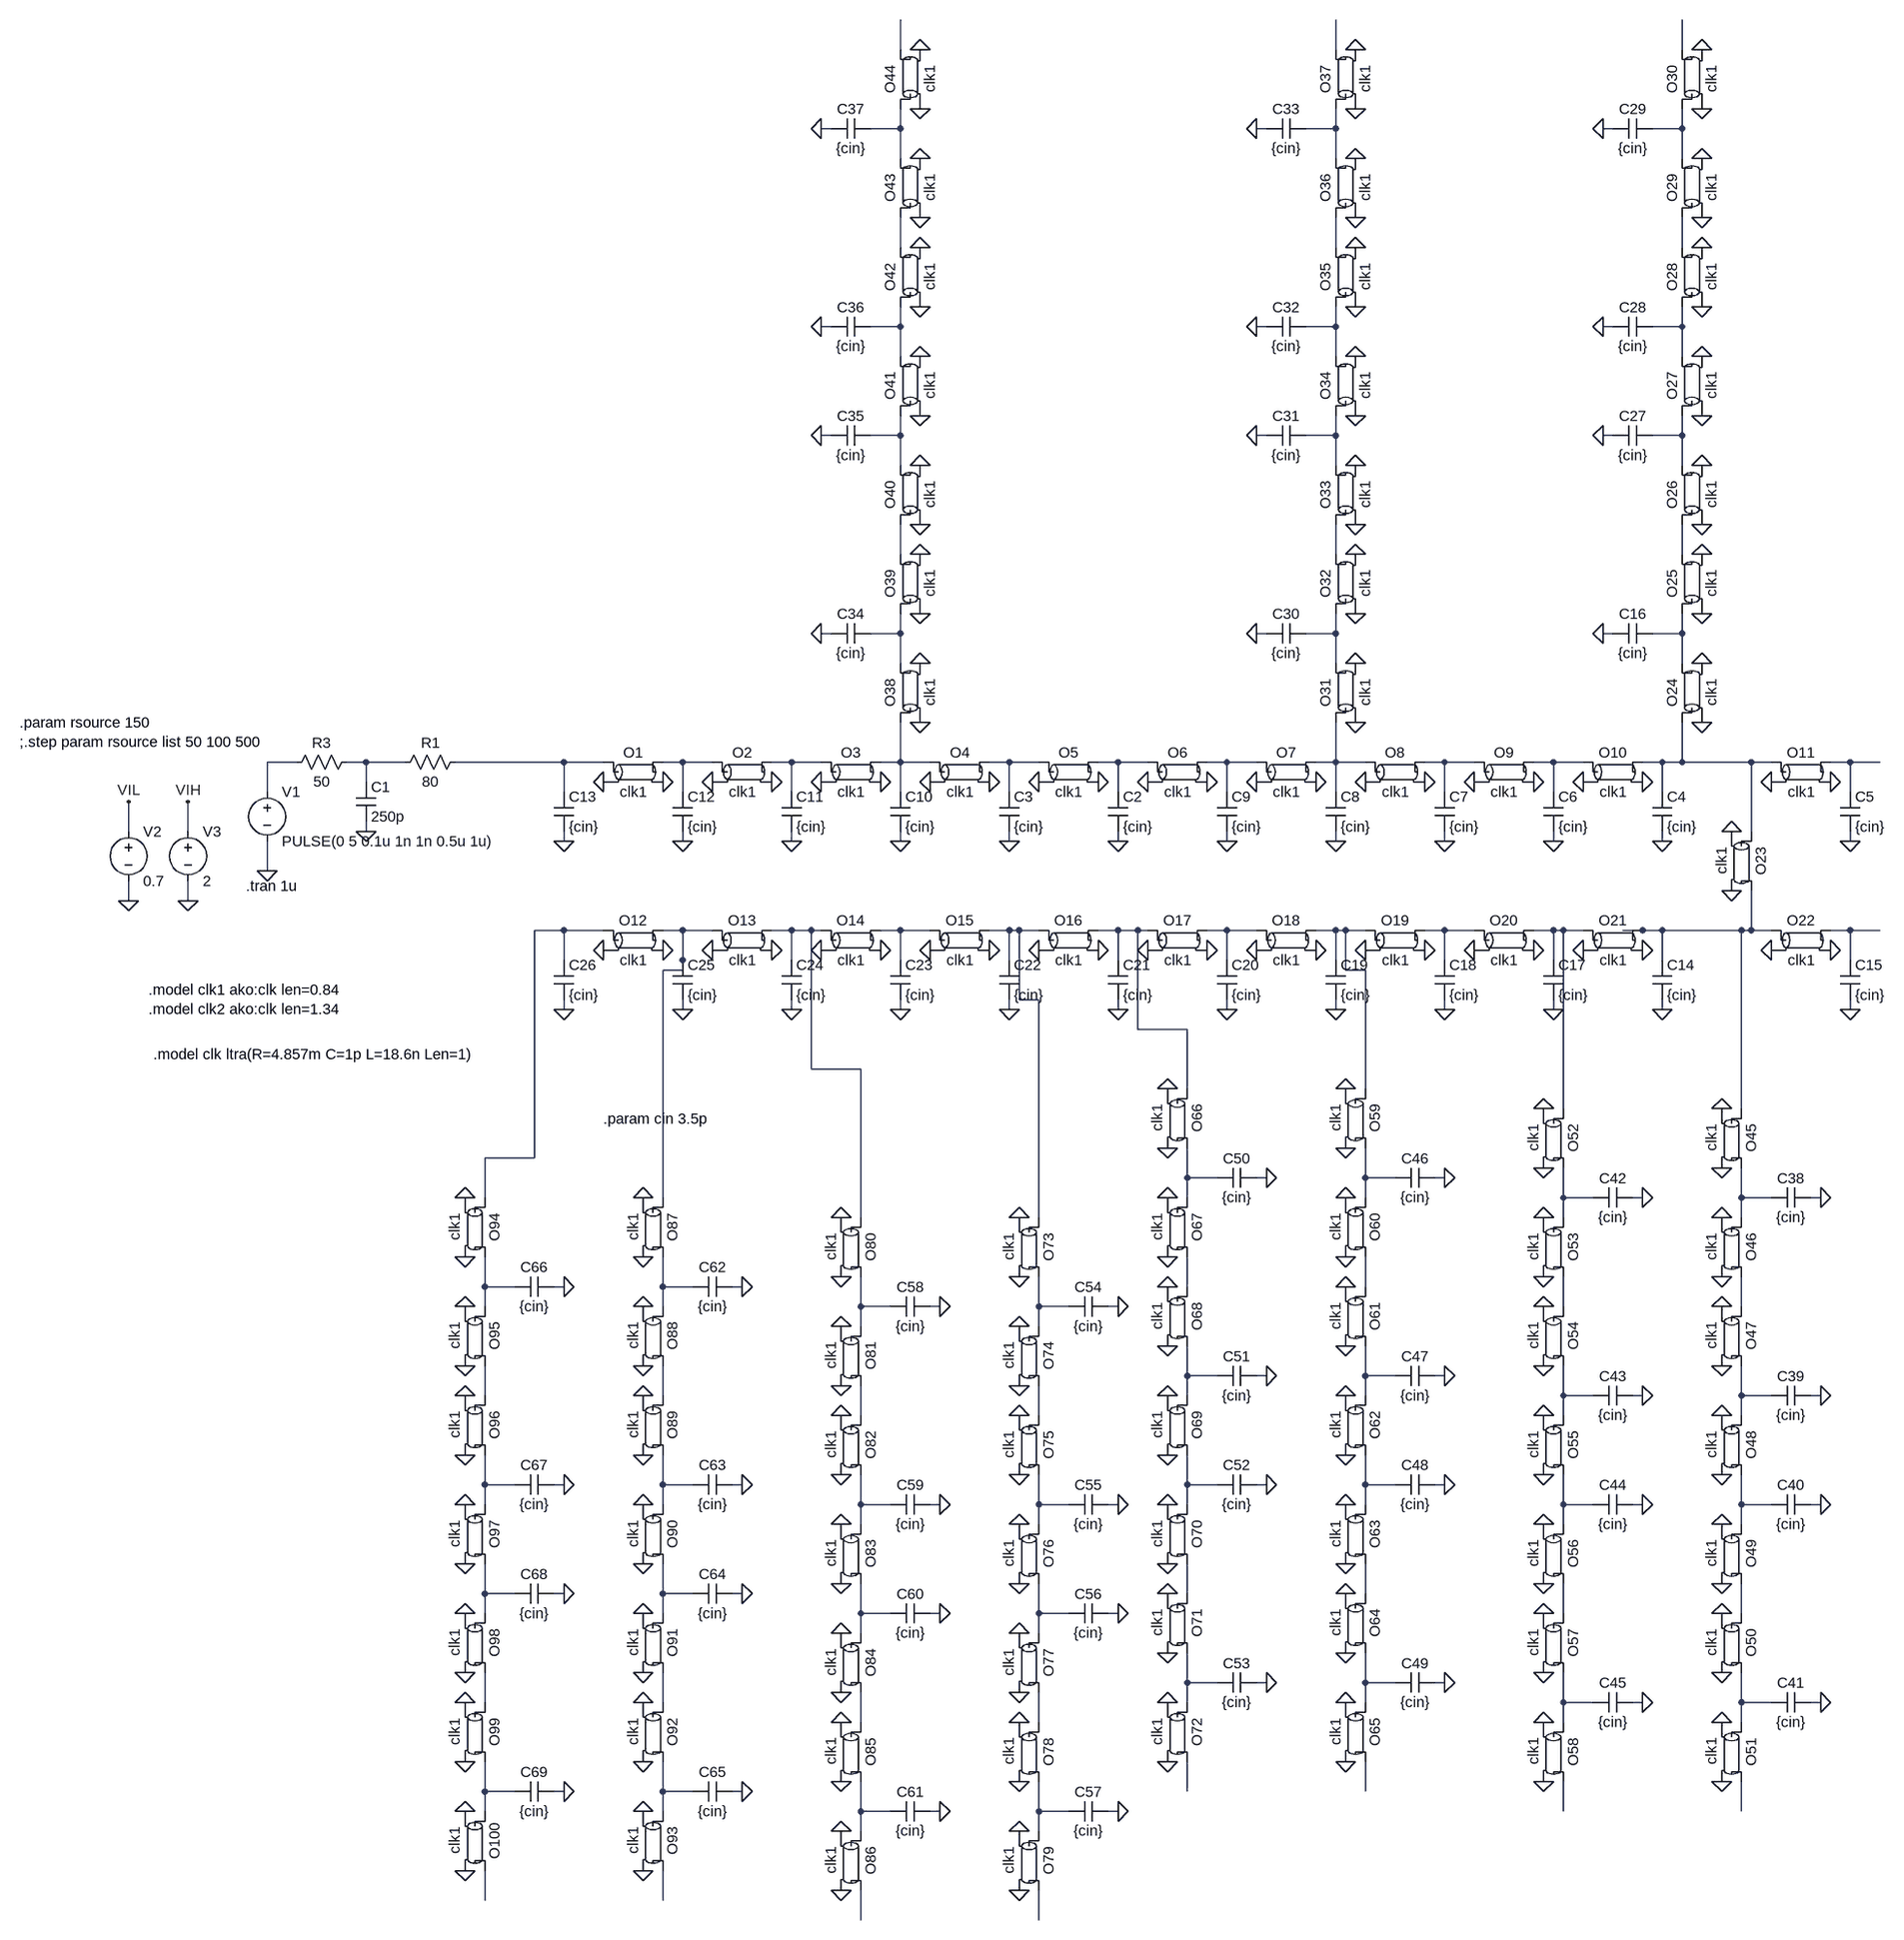
[diagram p0: schematic clock.asc]
clock.asc, the LTspice schematic file:
Version 4
SHEET 1 2964 1956
WIRE 848 -1072 848 -1120
WIRE 1552 -1072 1552 -1120
WIRE 2112 -1072 2112 -1120
WIRE 736 -944 720 -944
WIRE 848 -944 848 -976
WIRE 848 -944 800 -944
WIRE 1440 -944 1424 -944
WIRE 1552 -944 1552 -976
WIRE 1552 -944 1504 -944
WIRE 2000 -944 1984 -944
WIRE 2112 -944 2112 -976
WIRE 2112 -944 2064 -944
WIRE 848 -896 848 -944
WIRE 1552 -896 1552 -944
WIRE 2112 -896 2112 -944
WIRE 848 -752 848 -800
WIRE 1552 -752 1552 -800
WIRE 2112 -752 2112 -800
WIRE 736 -624 720 -624
WIRE 848 -624 848 -656
WIRE 848 -624 800 -624
WIRE 1440 -624 1424 -624
WIRE 1552 -624 1552 -656
WIRE 1552 -624 1504 -624
WIRE 2000 -624 1984 -624
WIRE 2112 -624 2112 -656
WIRE 2112 -624 2064 -624
WIRE 848 -576 848 -624
WIRE 1552 -576 1552 -624
WIRE 2112 -576 2112 -624
WIRE 736 -448 720 -448
WIRE 848 -448 848 -480
WIRE 848 -448 800 -448
WIRE 1440 -448 1424 -448
WIRE 1552 -448 1552 -480
WIRE 1552 -448 1504 -448
WIRE 2000 -448 1984 -448
WIRE 2112 -448 2112 -480
WIRE 2112 -448 2064 -448
WIRE 848 -400 848 -448
WIRE 1552 -400 1552 -448
WIRE 2112 -400 2112 -448
WIRE 848 -256 848 -304
WIRE 1552 -256 1552 -304
WIRE 2112 -256 2112 -304
WIRE 736 -128 720 -128
WIRE 848 -128 848 -160
WIRE 848 -128 800 -128
WIRE 1440 -128 1424 -128
WIRE 1552 -128 1552 -160
WIRE 1552 -128 1504 -128
WIRE 2000 -128 1984 -128
WIRE 2112 -128 2112 -160
WIRE 2112 -128 2064 -128
WIRE 848 -80 848 -128
WIRE 1552 -80 1552 -128
WIRE 2112 -80 2112 -128
WIRE -128 80 -176 80
WIRE -16 80 -48 80
WIRE 48 80 -16 80
WIRE 304 80 128 80
WIRE 368 80 304 80
WIRE 496 80 464 80
WIRE 544 80 496 80
WIRE 672 80 640 80
WIRE 720 80 672 80
WIRE 848 80 848 16
WIRE 848 80 816 80
WIRE 896 80 848 80
WIRE 1024 80 992 80
WIRE 1072 80 1024 80
WIRE 1200 80 1168 80
WIRE 1248 80 1200 80
WIRE 1376 80 1344 80
WIRE 1424 80 1376 80
WIRE 1552 80 1552 16
WIRE 1552 80 1520 80
WIRE 1600 80 1552 80
WIRE 1728 80 1696 80
WIRE 1776 80 1728 80
WIRE 1904 80 1872 80
WIRE 1952 80 1904 80
WIRE 2080 80 2048 80
WIRE 2112 80 2112 16
WIRE 2112 80 2080 80
WIRE 2224 80 2112 80
WIRE 2256 80 2224 80
WIRE 2384 80 2352 80
WIRE 2432 80 2384 80
WIRE -16 112 -16 80
WIRE -176 128 -176 80
WIRE 304 128 304 80
WIRE 496 128 496 80
WIRE 672 128 672 80
WIRE 848 128 848 80
WIRE 1024 128 1024 80
WIRE 1200 128 1200 80
WIRE 1376 128 1376 80
WIRE 1552 128 1552 80
WIRE 1728 128 1728 80
WIRE 1904 128 1904 80
WIRE 2080 128 2080 80
WIRE 2384 128 2384 80
WIRE -400 192 -400 144
WIRE -304 192 -304 144
WIRE -16 192 -16 176
WIRE 2224 192 2224 80
WIRE 304 208 304 192
WIRE 496 208 496 192
WIRE 672 208 672 192
WIRE 848 208 848 192
WIRE 1024 208 1024 192
WIRE 1200 208 1200 192
WIRE 1376 208 1376 192
WIRE 1552 208 1552 192
WIRE 1728 208 1728 192
WIRE 1904 208 1904 192
WIRE 2080 208 2080 192
WIRE 2384 208 2384 192
WIRE -176 256 -176 208
WIRE -400 304 -400 272
WIRE -304 304 -304 272
WIRE 304 352 256 352
WIRE 368 352 304 352
WIRE 496 352 464 352
WIRE 544 352 496 352
WIRE 672 352 640 352
WIRE 704 352 672 352
WIRE 720 352 704 352
WIRE 848 352 816 352
WIRE 896 352 848 352
WIRE 1024 352 992 352
WIRE 1040 352 1024 352
WIRE 1072 352 1040 352
WIRE 1200 352 1168 352
WIRE 1232 352 1200 352
WIRE 1248 352 1232 352
WIRE 1376 352 1344 352
WIRE 1424 352 1376 352
WIRE 1552 352 1520 352
WIRE 1568 352 1552 352
WIRE 1600 352 1568 352
WIRE 1728 352 1696 352
WIRE 1776 352 1728 352
WIRE 1904 352 1872 352
WIRE 1920 352 1904 352
WIRE 1952 352 1920 352
WIRE 2048 352 2016 352
WIRE 2080 352 2048 352
WIRE 2208 352 2080 352
WIRE 2224 352 2224 288
WIRE 2224 352 2208 352
WIRE 2256 352 2224 352
WIRE 2384 352 2352 352
WIRE 2432 352 2384 352
WIRE 304 400 304 352
WIRE 496 400 496 352
WIRE 672 400 672 352
WIRE 848 400 848 352
WIRE 1024 400 1024 352
WIRE 1200 400 1200 352
WIRE 1376 400 1376 352
WIRE 1552 400 1552 352
WIRE 1728 400 1728 352
WIRE 1904 400 1904 352
WIRE 2080 400 2080 352
WIRE 2384 400 2384 352
WIRE 496 416 496 400
WIRE 496 416 464 416
WIRE 1568 416 1568 352
WIRE 1600 416 1568 416
WIRE 1040 464 1040 352
WIRE 1072 464 1040 464
WIRE 304 480 304 464
WIRE 496 480 496 464
WIRE 672 480 672 464
WIRE 848 480 848 464
WIRE 1024 480 1024 464
WIRE 1200 480 1200 464
WIRE 1376 480 1376 464
WIRE 1552 480 1552 464
WIRE 1728 480 1728 464
WIRE 1904 480 1904 464
WIRE 2080 480 2080 464
WIRE 2384 480 2384 464
WIRE 1232 512 1232 352
WIRE 1312 512 1232 512
WIRE 704 576 704 352
WIRE 784 576 704 576
WIRE 1312 608 1312 512
WIRE 1600 608 1600 416
WIRE 1920 640 1920 352
WIRE 2208 640 2208 352
WIRE 256 720 256 352
WIRE 256 720 176 720
WIRE 1312 752 1312 704
WIRE 1360 752 1312 752
WIRE 1440 752 1424 752
WIRE 1600 752 1600 704
WIRE 1648 752 1600 752
WIRE 1728 752 1712 752
WIRE 176 784 176 720
WIRE 464 784 464 416
WIRE 1312 784 1312 752
WIRE 1600 784 1600 752
WIRE 1920 784 1920 736
WIRE 1968 784 1920 784
WIRE 2048 784 2032 784
WIRE 2208 784 2208 736
WIRE 2256 784 2208 784
WIRE 2336 784 2320 784
WIRE 784 816 784 576
WIRE 1072 816 1072 464
WIRE 1920 816 1920 784
WIRE 2208 816 2208 784
WIRE 176 928 176 880
WIRE 224 928 176 928
WIRE 304 928 288 928
WIRE 464 928 464 880
WIRE 512 928 464 928
WIRE 592 928 576 928
WIRE 1312 928 1312 880
WIRE 1600 928 1600 880
WIRE 176 960 176 928
WIRE 464 960 464 928
WIRE 784 960 784 912
WIRE 832 960 784 960
WIRE 912 960 896 960
WIRE 1072 960 1072 912
WIRE 1120 960 1072 960
WIRE 1200 960 1184 960
WIRE 1920 960 1920 912
WIRE 2208 960 2208 912
WIRE 784 992 784 960
WIRE 1072 992 1072 960
WIRE 1312 1072 1312 1024
WIRE 1360 1072 1312 1072
WIRE 1440 1072 1424 1072
WIRE 1600 1072 1600 1024
WIRE 1648 1072 1600 1072
WIRE 1728 1072 1712 1072
WIRE 176 1104 176 1056
WIRE 464 1104 464 1056
WIRE 1312 1104 1312 1072
WIRE 1600 1104 1600 1072
WIRE 1920 1104 1920 1056
WIRE 1968 1104 1920 1104
WIRE 2048 1104 2032 1104
WIRE 2208 1104 2208 1056
WIRE 2256 1104 2208 1104
WIRE 2336 1104 2320 1104
WIRE 784 1136 784 1088
WIRE 1072 1136 1072 1088
WIRE 1920 1136 1920 1104
WIRE 2208 1136 2208 1104
WIRE 176 1248 176 1200
WIRE 224 1248 176 1248
WIRE 304 1248 288 1248
WIRE 464 1248 464 1200
WIRE 512 1248 464 1248
WIRE 592 1248 576 1248
WIRE 1312 1248 1312 1200
WIRE 1360 1248 1312 1248
WIRE 1440 1248 1424 1248
WIRE 1600 1248 1600 1200
WIRE 1648 1248 1600 1248
WIRE 1728 1248 1712 1248
WIRE 176 1280 176 1248
WIRE 464 1280 464 1248
WIRE 784 1280 784 1232
WIRE 832 1280 784 1280
WIRE 912 1280 896 1280
WIRE 1072 1280 1072 1232
WIRE 1120 1280 1072 1280
WIRE 1200 1280 1184 1280
WIRE 1312 1280 1312 1248
WIRE 1600 1280 1600 1248
WIRE 1920 1280 1920 1232
WIRE 1968 1280 1920 1280
WIRE 2048 1280 2032 1280
WIRE 2208 1280 2208 1232
WIRE 2256 1280 2208 1280
WIRE 2336 1280 2320 1280
WIRE 784 1312 784 1280
WIRE 1072 1312 1072 1280
WIRE 1920 1312 1920 1280
WIRE 2208 1312 2208 1280
WIRE 176 1424 176 1376
WIRE 224 1424 176 1424
WIRE 304 1424 288 1424
WIRE 464 1424 464 1376
WIRE 512 1424 464 1424
WIRE 592 1424 576 1424
WIRE 1312 1424 1312 1376
WIRE 1600 1424 1600 1376
WIRE 176 1456 176 1424
WIRE 464 1456 464 1424
WIRE 784 1456 784 1408
WIRE 832 1456 784 1456
WIRE 912 1456 896 1456
WIRE 1072 1456 1072 1408
WIRE 1120 1456 1072 1456
WIRE 1200 1456 1184 1456
WIRE 1920 1456 1920 1408
WIRE 2208 1456 2208 1408
WIRE 784 1488 784 1456
WIRE 1072 1488 1072 1456
WIRE 1312 1568 1312 1520
WIRE 1360 1568 1312 1568
WIRE 1440 1568 1424 1568
WIRE 1600 1568 1600 1520
WIRE 1648 1568 1600 1568
WIRE 1728 1568 1712 1568
WIRE 176 1600 176 1552
WIRE 464 1600 464 1552
WIRE 1312 1600 1312 1568
WIRE 1600 1600 1600 1568
WIRE 1920 1600 1920 1552
WIRE 1968 1600 1920 1600
WIRE 2048 1600 2032 1600
WIRE 2208 1600 2208 1552
WIRE 2256 1600 2208 1600
WIRE 2336 1600 2320 1600
WIRE 784 1632 784 1584
WIRE 1072 1632 1072 1584
WIRE 1920 1632 1920 1600
WIRE 2208 1632 2208 1600
WIRE 176 1744 176 1696
WIRE 224 1744 176 1744
WIRE 304 1744 288 1744
WIRE 464 1744 464 1696
WIRE 512 1744 464 1744
WIRE 592 1744 576 1744
WIRE 1312 1744 1312 1696
WIRE 1600 1744 1600 1696
WIRE 176 1776 176 1744
WIRE 464 1776 464 1744
WIRE 784 1776 784 1728
WIRE 832 1776 784 1776
WIRE 912 1776 896 1776
WIRE 1072 1776 1072 1728
WIRE 1120 1776 1072 1776
WIRE 1200 1776 1184 1776
WIRE 1920 1776 1920 1728
WIRE 2208 1776 2208 1728
WIRE 784 1808 784 1776
WIRE 1072 1808 1072 1776
WIRE 176 1920 176 1872
WIRE 464 1920 464 1872
WIRE 784 1952 784 1904
WIRE 1072 1952 1072 1904
FLAG -176 256 0
FLAG 368 112 0
FLAG 464 112 0
FLAG 544 112 0
FLAG 640 112 0
FLAG 720 112 0
FLAG 816 112 0
FLAG 896 112 0
FLAG 992 112 0
FLAG 1072 112 0
FLAG 1168 112 0
FLAG 1248 112 0
FLAG 1344 112 0
FLAG 1424 112 0
FLAG 1520 112 0
FLAG 1600 112 0
FLAG 1696 112 0
FLAG 1776 112 0
FLAG 1872 112 0
FLAG 1952 112 0
FLAG 2048 112 0
FLAG 2256 112 0
FLAG 2352 112 0
FLAG 368 384 0
FLAG 464 384 0
FLAG 544 384 0
FLAG 640 384 0
FLAG 720 384 0
FLAG 816 384 0
FLAG 896 384 0
FLAG 992 384 0
FLAG 1168 384 0
FLAG 1248 384 0
FLAG 1344 384 0
FLAG 1424 384 0
FLAG 1520 384 0
FLAG 1600 384 0
FLAG 1696 384 0
FLAG 1776 384 0
FLAG 1872 384 0
FLAG 1952 384 0
FLAG 2048 384 0
FLAG 2256 384 0
FLAG 2352 384 0
FLAG 2192 192 0
FLAG 2192 288 0
FLAG -304 304 0
FLAG -304 144 VIH
FLAG -400 304 0
FLAG -400 144 VIL
FLAG 1072 384 0
FLAG 1200 208 0
FLAG 1024 208 0
FLAG 2080 208 0
FLAG 2384 208 0
FLAG 1904 208 0
FLAG 1728 208 0
FLAG 1552 208 0
FLAG 1376 208 0
FLAG 848 208 0
FLAG 672 208 0
FLAG 496 208 0
FLAG 304 208 0
FLAG 2080 480 0
FLAG 2384 480 0
FLAG 1904 480 0
FLAG 1728 480 0
FLAG 1552 480 0
FLAG 1376 480 0
FLAG 1200 480 0
FLAG 1024 480 0
FLAG 848 480 0
FLAG 672 480 0
FLAG 496 480 0
FLAG 304 480 0
FLAG -16 192 0
FLAG 2144 16 0
FLAG 2144 -80 0
FLAG 2144 -160 0
FLAG 2144 -256 0
FLAG 1984 -128 0
FLAG 2144 -304 0
FLAG 2144 -400 0
FLAG 2144 -480 0
FLAG 2144 -576 0
FLAG 1984 -448 0
FLAG 2144 -656 0
FLAG 2144 -752 0
FLAG 1984 -624 0
FLAG 2144 -800 0
FLAG 2144 -896 0
FLAG 2144 -976 0
FLAG 2144 -1072 0
FLAG 1984 -944 0
FLAG 1584 16 0
FLAG 1584 -80 0
FLAG 1584 -160 0
FLAG 1584 -256 0
FLAG 1424 -128 0
FLAG 1584 -304 0
FLAG 1584 -400 0
FLAG 1584 -480 0
FLAG 1584 -576 0
FLAG 1424 -448 0
FLAG 1584 -656 0
FLAG 1584 -752 0
FLAG 1424 -624 0
FLAG 1584 -800 0
FLAG 1584 -896 0
FLAG 1584 -976 0
FLAG 1584 -1072 0
FLAG 1424 -944 0
FLAG 880 16 0
FLAG 880 -80 0
FLAG 880 -160 0
FLAG 880 -256 0
FLAG 720 -128 0
FLAG 880 -304 0
FLAG 880 -400 0
FLAG 880 -480 0
FLAG 880 -576 0
FLAG 720 -448 0
FLAG 880 -656 0
FLAG 880 -752 0
FLAG 720 -624 0
FLAG 880 -800 0
FLAG 880 -896 0
FLAG 880 -976 0
FLAG 880 -1072 0
FLAG 720 -944 0
FLAG 2176 640 0
FLAG 2176 736 0
FLAG 2176 816 0
FLAG 2176 912 0
FLAG 2336 784 0
FLAG 2176 960 0
FLAG 2176 1056 0
FLAG 2176 1136 0
FLAG 2176 1232 0
FLAG 2336 1104 0
FLAG 2176 1312 0
FLAG 2176 1408 0
FLAG 2336 1280 0
FLAG 2176 1456 0
FLAG 2176 1552 0
FLAG 2176 1632 0
FLAG 2176 1728 0
FLAG 2336 1600 0
FLAG 1888 640 0
FLAG 1888 736 0
FLAG 1888 816 0
FLAG 1888 912 0
FLAG 2048 784 0
FLAG 1888 960 0
FLAG 1888 1056 0
FLAG 1888 1136 0
FLAG 1888 1232 0
FLAG 2048 1104 0
FLAG 1888 1312 0
FLAG 1888 1408 0
FLAG 2048 1280 0
FLAG 1888 1456 0
FLAG 1888 1552 0
FLAG 1888 1632 0
FLAG 1888 1728 0
FLAG 2048 1600 0
FLAG 1568 608 0
FLAG 1568 704 0
FLAG 1568 784 0
FLAG 1568 880 0
FLAG 1728 752 0
FLAG 1568 928 0
FLAG 1568 1024 0
FLAG 1568 1104 0
FLAG 1568 1200 0
FLAG 1728 1072 0
FLAG 1568 1280 0
FLAG 1568 1376 0
FLAG 1728 1248 0
FLAG 1568 1424 0
FLAG 1568 1520 0
FLAG 1568 1600 0
FLAG 1568 1696 0
FLAG 1728 1568 0
FLAG 1280 608 0
FLAG 1280 704 0
FLAG 1280 784 0
FLAG 1280 880 0
FLAG 1440 752 0
FLAG 1280 928 0
FLAG 1280 1024 0
FLAG 1280 1104 0
FLAG 1280 1200 0
FLAG 1440 1072 0
FLAG 1280 1280 0
FLAG 1280 1376 0
FLAG 1440 1248 0
FLAG 1280 1424 0
FLAG 1280 1520 0
FLAG 1280 1600 0
FLAG 1280 1696 0
FLAG 1440 1568 0
FLAG 1040 816 0
FLAG 1040 912 0
FLAG 1040 992 0
FLAG 1040 1088 0
FLAG 1200 960 0
FLAG 1040 1136 0
FLAG 1040 1232 0
FLAG 1040 1312 0
FLAG 1040 1408 0
FLAG 1200 1280 0
FLAG 1040 1488 0
FLAG 1040 1584 0
FLAG 1200 1456 0
FLAG 1040 1632 0
FLAG 1040 1728 0
FLAG 1040 1808 0
FLAG 1040 1904 0
FLAG 1200 1776 0
FLAG 752 816 0
FLAG 752 912 0
FLAG 752 992 0
FLAG 752 1088 0
FLAG 912 960 0
FLAG 752 1136 0
FLAG 752 1232 0
FLAG 752 1312 0
FLAG 752 1408 0
FLAG 912 1280 0
FLAG 752 1488 0
FLAG 752 1584 0
FLAG 912 1456 0
FLAG 752 1632 0
FLAG 752 1728 0
FLAG 752 1808 0
FLAG 752 1904 0
FLAG 912 1776 0
FLAG 432 784 0
FLAG 432 880 0
FLAG 432 960 0
FLAG 432 1056 0
FLAG 592 928 0
FLAG 432 1104 0
FLAG 432 1200 0
FLAG 432 1280 0
FLAG 432 1376 0
FLAG 592 1248 0
FLAG 432 1456 0
FLAG 432 1552 0
FLAG 592 1424 0
FLAG 432 1600 0
FLAG 432 1696 0
FLAG 432 1776 0
FLAG 432 1872 0
FLAG 592 1744 0
FLAG 144 784 0
FLAG 144 880 0
FLAG 144 960 0
FLAG 144 1056 0
FLAG 304 928 0
FLAG 144 1104 0
FLAG 144 1200 0
FLAG 144 1280 0
FLAG 144 1376 0
FLAG 304 1248 0
FLAG 144 1456 0
FLAG 144 1552 0
FLAG 304 1424 0
FLAG 144 1600 0
FLAG 144 1696 0
FLAG 144 1776 0
FLAG 144 1872 0
FLAG 304 1744 0
SYMBOL voltage -176 112 R0
WINDOW 123 0 0 Left 0
WINDOW 39 0 0 Left 0
SYMATTR InstName V1
SYMATTR Value PULSE(0 5 0.1u 1n 1n 0.5u 1u)
SYMBOL res 144 64 R90
WINDOW 0 0 56 VBottom 2
WINDOW 3 32 56 VTop 2
SYMATTR InstName R1
SYMATTR Value 80
SYMBOL ltline 416 96 R0
SYMATTR InstName O1
SYMATTR Value clk1
SYMBOL ltline 592 96 R0
SYMATTR InstName O2
SYMATTR Value clk1
SYMBOL ltline 768 96 R0
SYMATTR InstName O3
SYMATTR Value clk1
SYMBOL ltline 944 96 R0
SYMATTR InstName O4
SYMATTR Value clk1
SYMBOL ltline 1120 96 R0
SYMATTR InstName O5
SYMATTR Value clk1
SYMBOL ltline 1296 96 R0
SYMATTR InstName O6
SYMATTR Value clk1
SYMBOL ltline 1472 96 R0
SYMATTR InstName O7
SYMATTR Value clk1
SYMBOL ltline 1648 96 R0
SYMATTR InstName O8
SYMATTR Value clk1
SYMBOL ltline 1824 96 R0
SYMATTR InstName O9
SYMATTR Value clk1
SYMBOL ltline 2000 96 R0
SYMATTR InstName O10
SYMATTR Value clk1
SYMBOL ltline 2304 96 R0
SYMATTR InstName O11
SYMATTR Value clk1
SYMBOL ltline 416 368 R0
SYMATTR InstName O12
SYMATTR Value clk1
SYMBOL ltline 592 368 R0
SYMATTR InstName O13
SYMATTR Value clk1
SYMBOL ltline 768 368 R0
SYMATTR InstName O14
SYMATTR Value clk1
SYMBOL ltline 944 368 R0
SYMATTR InstName O15
SYMATTR Value clk1
SYMBOL ltline 1120 368 R0
SYMATTR InstName O16
SYMATTR Value clk1
SYMBOL ltline 1296 368 R0
SYMATTR InstName O17
SYMATTR Value clk1
SYMBOL ltline 1472 368 R0
SYMATTR InstName O18
SYMATTR Value clk1
SYMBOL ltline 1648 368 R0
SYMATTR InstName O19
SYMATTR Value clk1
SYMBOL ltline 1824 368 R0
SYMATTR InstName O20
SYMATTR Value clk1
SYMBOL ltline 2000 368 R0
SYMATTR InstName O21
SYMATTR Value clk1
SYMBOL ltline 2304 368 R0
SYMATTR InstName O22
SYMATTR Value clk1
SYMBOL ltline 2208 240 R90
SYMATTR InstName O23
SYMATTR Value clk1
SYMBOL voltage -304 176 R0
WINDOW 123 0 0 Left 0
WINDOW 39 0 0 Left 0
SYMATTR InstName V3
SYMATTR Value 2
SYMBOL voltage -400 176 R0
WINDOW 123 0 0 Left 0
WINDOW 39 0 0 Left 0
SYMATTR InstName V2
SYMATTR Value 0.7
SYMBOL cap 1184 128 R0
SYMATTR InstName C2
SYMATTR Value {cin}
SYMBOL cap 1008 128 R0
SYMATTR InstName C3
SYMATTR Value {cin}
SYMBOL cap 2064 128 R0
SYMATTR InstName C4
SYMATTR Value {cin}
SYMBOL cap 2368 128 R0
SYMATTR InstName C5
SYMATTR Value {cin}
SYMBOL cap 1888 128 R0
SYMATTR InstName C6
SYMATTR Value {cin}
SYMBOL cap 1712 128 R0
SYMATTR InstName C7
SYMATTR Value {cin}
SYMBOL cap 1536 128 R0
SYMATTR InstName C8
SYMATTR Value {cin}
SYMBOL cap 1360 128 R0
SYMATTR InstName C9
SYMATTR Value {cin}
SYMBOL cap 832 128 R0
SYMATTR InstName C10
SYMATTR Value {cin}
SYMBOL cap 656 128 R0
SYMATTR InstName C11
SYMATTR Value {cin}
SYMBOL cap 480 128 R0
SYMATTR InstName C12
SYMATTR Value {cin}
SYMBOL cap 288 128 R0
SYMATTR InstName C13
SYMATTR Value {cin}
SYMBOL cap 2064 400 R0
SYMATTR InstName C14
SYMATTR Value {cin}
SYMBOL cap 2368 400 R0
SYMATTR InstName C15
SYMATTR Value {cin}
SYMBOL cap 1888 400 R0
SYMATTR InstName C17
SYMATTR Value {cin}
SYMBOL cap 1712 400 R0
SYMATTR InstName C18
SYMATTR Value {cin}
SYMBOL cap 1536 400 R0
SYMATTR InstName C19
SYMATTR Value {cin}
SYMBOL cap 1360 400 R0
SYMATTR InstName C20
SYMATTR Value {cin}
SYMBOL cap 1184 400 R0
SYMATTR InstName C21
SYMATTR Value {cin}
SYMBOL cap 1008 400 R0
SYMATTR InstName C22
SYMATTR Value {cin}
SYMBOL cap 832 400 R0
SYMATTR InstName C23
SYMATTR Value {cin}
SYMBOL cap 656 400 R0
SYMATTR InstName C24
SYMATTR Value {cin}
SYMBOL cap 480 400 R0
SYMATTR InstName C25
SYMATTR Value {cin}
SYMBOL cap 288 400 R0
SYMATTR InstName C26
SYMATTR Value {cin}
SYMBOL cap -32 112 R0
SYMATTR InstName C1
SYMATTR Value 250p
SYMBOL res -32 64 R90
WINDOW 0 0 56 VBottom 2
WINDOW 3 32 56 VTop 2
SYMATTR InstName R3
SYMATTR Value 50
SYMBOL ltline 2128 -32 R270
SYMATTR InstName O24
SYMATTR Value clk1
SYMBOL ltline 2128 -208 R270
SYMATTR InstName O25
SYMATTR Value clk1
SYMBOL cap 2064 -144 R90
WINDOW 0 0 32 VBottom 2
WINDOW 3 32 32 VTop 2
SYMATTR InstName C16
SYMATTR Value {cin}
SYMBOL ltline 2128 -352 R270
SYMATTR InstName O26
SYMATTR Value clk1
SYMBOL ltline 2128 -528 R270
SYMATTR InstName O27
SYMATTR Value clk1
SYMBOL cap 2064 -464 R90
WINDOW 0 0 32 VBottom 2
WINDOW 3 32 32 VTop 2
SYMATTR InstName C27
SYMATTR Value {cin}
SYMBOL ltline 2128 -704 R270
SYMATTR InstName O28
SYMATTR Value clk1
SYMBOL cap 2064 -640 R90
WINDOW 0 0 32 VBottom 2
WINDOW 3 32 32 VTop 2
SYMATTR InstName C28
SYMATTR Value {cin}
SYMBOL ltline 2128 -848 R270
SYMATTR InstName O29
SYMATTR Value clk1
SYMBOL ltline 2128 -1024 R270
SYMATTR InstName O30
SYMATTR Value clk1
SYMBOL cap 2064 -960 R90
WINDOW 0 0 32 VBottom 2
WINDOW 3 32 32 VTop 2
SYMATTR InstName C29
SYMATTR Value {cin}
SYMBOL ltline 1568 -32 R270
SYMATTR InstName O31
SYMATTR Value clk1
SYMBOL ltline 1568 -208 R270
SYMATTR InstName O32
SYMATTR Value clk1
SYMBOL cap 1504 -144 R90
WINDOW 0 0 32 VBottom 2
WINDOW 3 32 32 VTop 2
SYMATTR InstName C30
SYMATTR Value {cin}
SYMBOL ltline 1568 -352 R270
SYMATTR InstName O33
SYMATTR Value clk1
SYMBOL ltline 1568 -528 R270
SYMATTR InstName O34
SYMATTR Value clk1
SYMBOL cap 1504 -464 R90
WINDOW 0 0 32 VBottom 2
WINDOW 3 32 32 VTop 2
SYMATTR InstName C31
SYMATTR Value {cin}
SYMBOL ltline 1568 -704 R270
SYMATTR InstName O35
SYMATTR Value clk1
SYMBOL cap 1504 -640 R90
WINDOW 0 0 32 VBottom 2
WINDOW 3 32 32 VTop 2
SYMATTR InstName C32
SYMATTR Value {cin}
SYMBOL ltline 1568 -848 R270
SYMATTR InstName O36
SYMATTR Value clk1
SYMBOL ltline 1568 -1024 R270
SYMATTR InstName O37
SYMATTR Value clk1
SYMBOL cap 1504 -960 R90
WINDOW 0 0 32 VBottom 2
WINDOW 3 32 32 VTop 2
SYMATTR InstName C33
SYMATTR Value {cin}
SYMBOL ltline 864 -32 R270
SYMATTR InstName O38
SYMATTR Value clk1
SYMBOL ltline 864 -208 R270
SYMATTR InstName O39
SYMATTR Value clk1
SYMBOL cap 800 -144 R90
WINDOW 0 0 32 VBottom 2
WINDOW 3 32 32 VTop 2
SYMATTR InstName C34
SYMATTR Value {cin}
SYMBOL ltline 864 -352 R270
SYMATTR InstName O40
SYMATTR Value clk1
SYMBOL ltline 864 -528 R270
SYMATTR InstName O41
SYMATTR Value clk1
SYMBOL cap 800 -464 R90
WINDOW 0 0 32 VBottom 2
WINDOW 3 32 32 VTop 2
SYMATTR InstName C35
SYMATTR Value {cin}
SYMBOL ltline 864 -704 R270
SYMATTR InstName O42
SYMATTR Value clk1
SYMBOL cap 800 -640 R90
WINDOW 0 0 32 VBottom 2
WINDOW 3 32 32 VTop 2
SYMATTR InstName C36
SYMATTR Value {cin}
SYMBOL ltline 864 -848 R270
SYMATTR InstName O43
SYMATTR Value clk1
SYMBOL ltline 864 -1024 R270
SYMATTR InstName O44
SYMATTR Value clk1
SYMBOL cap 800 -960 R90
WINDOW 0 0 32 VBottom 2
WINDOW 3 32 32 VTop 2
SYMATTR InstName C37
SYMATTR Value {cin}
SYMBOL ltline 2192 688 R90
SYMATTR InstName O45
SYMATTR Value clk1
SYMBOL ltline 2192 864 R90
SYMATTR InstName O46
SYMATTR Value clk1
SYMBOL cap 2256 800 R270
WINDOW 0 32 32 VTop 2
WINDOW 3 0 32 VBottom 2
SYMATTR InstName C38
SYMATTR Value {cin}
SYMBOL ltline 2192 1008 R90
SYMATTR InstName O47
SYMATTR Value clk1
SYMBOL ltline 2192 1184 R90
SYMATTR InstName O48
SYMATTR Value clk1
SYMBOL cap 2256 1120 R270
WINDOW 0 32 32 VTop 2
WINDOW 3 0 32 VBottom 2
SYMATTR InstName C39
SYMATTR Value {cin}
SYMBOL ltline 2192 1360 R90
SYMATTR InstName O49
SYMATTR Value clk1
SYMBOL cap 2256 1296 R270
WINDOW 0 32 32 VTop 2
WINDOW 3 0 32 VBottom 2
SYMATTR InstName C40
SYMATTR Value {cin}
SYMBOL ltline 2192 1504 R90
SYMATTR InstName O50
SYMATTR Value clk1
SYMBOL ltline 2192 1680 R90
SYMATTR InstName O51
SYMATTR Value clk1
SYMBOL cap 2256 1616 R270
WINDOW 0 32 32 VTop 2
WINDOW 3 0 32 VBottom 2
SYMATTR InstName C41
SYMATTR Value {cin}
SYMBOL ltline 1904 688 R90
SYMATTR InstName O52
SYMATTR Value clk1
SYMBOL ltline 1904 864 R90
SYMATTR InstName O53
SYMATTR Value clk1
SYMBOL cap 1968 800 R270
WINDOW 0 32 32 VTop 2
WINDOW 3 0 32 VBottom 2
SYMATTR InstName C42
SYMATTR Value {cin}
SYMBOL ltline 1904 1008 R90
SYMATTR InstName O54
SYMATTR Value clk1
SYMBOL ltline 1904 1184 R90
SYMATTR InstName O55
SYMATTR Value clk1
SYMBOL cap 1968 1120 R270
WINDOW 0 32 32 VTop 2
WINDOW 3 0 32 VBottom 2
SYMATTR InstName C43
SYMATTR Value {cin}
SYMBOL ltline 1904 1360 R90
SYMATTR InstName O56
SYMATTR Value clk1
SYMBOL cap 1968 1296 R270
WINDOW 0 32 32 VTop 2
WINDOW 3 0 32 VBottom 2
SYMATTR InstName C44
SYMATTR Value {cin}
SYMBOL ltline 1904 1504 R90
SYMATTR InstName O57
SYMATTR Value clk1
SYMBOL ltline 1904 1680 R90
SYMATTR InstName O58
SYMATTR Value clk1
SYMBOL cap 1968 1616 R270
WINDOW 0 32 32 VTop 2
WINDOW 3 0 32 VBottom 2
SYMATTR InstName C45
SYMATTR Value {cin}
SYMBOL ltline 1584 656 R90
SYMATTR InstName O59
SYMATTR Value clk1
SYMBOL ltline 1584 832 R90
SYMATTR InstName O60
SYMATTR Value clk1
SYMBOL cap 1648 768 R270
WINDOW 0 32 32 VTop 2
WINDOW 3 0 32 VBottom 2
SYMATTR InstName C46
SYMATTR Value {cin}
SYMBOL ltline 1584 976 R90
SYMATTR InstName O61
SYMATTR Value clk1
SYMBOL ltline 1584 1152 R90
SYMATTR InstName O62
SYMATTR Value clk1
SYMBOL cap 1648 1088 R270
WINDOW 0 32 32 VTop 2
WINDOW 3 0 32 VBottom 2
SYMATTR InstName C47
SYMATTR Value {cin}
SYMBOL ltline 1584 1328 R90
SYMATTR InstName O63
SYMATTR Value clk1
SYMBOL cap 1648 1264 R270
WINDOW 0 32 32 VTop 2
WINDOW 3 0 32 VBottom 2
SYMATTR InstName C48
SYMATTR Value {cin}
SYMBOL ltline 1584 1472 R90
SYMATTR InstName O64
SYMATTR Value clk1
SYMBOL ltline 1584 1648 R90
SYMATTR InstName O65
SYMATTR Value clk1
SYMBOL cap 1648 1584 R270
WINDOW 0 32 32 VTop 2
WINDOW 3 0 32 VBottom 2
SYMATTR InstName C49
SYMATTR Value {cin}
SYMBOL ltline 1296 656 R90
SYMATTR InstName O66
SYMATTR Value clk1
SYMBOL ltline 1296 832 R90
SYMATTR InstName O67
SYMATTR Value clk1
SYMBOL cap 1360 768 R270
WINDOW 0 32 32 VTop 2
WINDOW 3 0 32 VBottom 2
SYMATTR InstName C50
SYMATTR Value {cin}
SYMBOL ltline 1296 976 R90
SYMATTR InstName O68
SYMATTR Value clk1
SYMBOL ltline 1296 1152 R90
SYMATTR InstName O69
SYMATTR Value clk1
SYMBOL cap 1360 1088 R270
WINDOW 0 32 32 VTop 2
WINDOW 3 0 32 VBottom 2
SYMATTR InstName C51
SYMATTR Value {cin}
SYMBOL ltline 1296 1328 R90
SYMATTR InstName O70
SYMATTR Value clk1
SYMBOL cap 1360 1264 R270
WINDOW 0 32 32 VTop 2
WINDOW 3 0 32 VBottom 2
SYMATTR InstName C52
SYMATTR Value {cin}
SYMBOL ltline 1296 1472 R90
SYMATTR InstName O71
SYMATTR Value clk1
SYMBOL ltline 1296 1648 R90
SYMATTR InstName O72
SYMATTR Value clk1
SYMBOL cap 1360 1584 R270
WINDOW 0 32 32 VTop 2
WINDOW 3 0 32 VBottom 2
SYMATTR InstName C53
SYMATTR Value {cin}
SYMBOL ltline 1056 864 R90
SYMATTR InstName O73
SYMATTR Value clk1
SYMBOL ltline 1056 1040 R90
SYMATTR InstName O74
SYMATTR Value clk1
SYMBOL cap 1120 976 R270
WINDOW 0 32 32 VTop 2
WINDOW 3 0 32 VBottom 2
SYMATTR InstName C54
SYMATTR Value {cin}
SYMBOL ltline 1056 1184 R90
SYMATTR InstName O75
SYMATTR Value clk1
SYMBOL ltline 1056 1360 R90
SYMATTR InstName O76
SYMATTR Value clk1
SYMBOL cap 1120 1296 R270
WINDOW 0 32 32 VTop 2
WINDOW 3 0 32 VBottom 2
SYMATTR InstName C55
SYMATTR Value {cin}
SYMBOL ltline 1056 1536 R90
SYMATTR InstName O77
SYMATTR Value clk1
SYMBOL cap 1120 1472 R270
WINDOW 0 32 32 VTop 2
WINDOW 3 0 32 VBottom 2
SYMATTR InstName C56
SYMATTR Value {cin}
SYMBOL ltline 1056 1680 R90
SYMATTR InstName O78
SYMATTR Value clk1
SYMBOL ltline 1056 1856 R90
SYMATTR InstName O79
SYMATTR Value clk1
SYMBOL cap 1120 1792 R270
WINDOW 0 32 32 VTop 2
WINDOW 3 0 32 VBottom 2
SYMATTR InstName C57
SYMATTR Value {cin}
SYMBOL ltline 768 864 R90
SYMATTR InstName O80
SYMATTR Value clk1
SYMBOL ltline 768 1040 R90
SYMATTR InstName O81
SYMATTR Value clk1
SYMBOL cap 832 976 R270
WINDOW 0 32 32 VTop 2
WINDOW 3 0 32 VBottom 2
SYMATTR InstName C58
SYMATTR Value {cin}
SYMBOL ltline 768 1184 R90
SYMATTR InstName O82
SYMATTR Value clk1
SYMBOL ltline 768 1360 R90
SYMATTR InstName O83
SYMATTR Value clk1
SYMBOL cap 832 1296 R270
WINDOW 0 32 32 VTop 2
WINDOW 3 0 32 VBottom 2
SYMATTR InstName C59
SYMATTR Value {cin}
SYMBOL ltline 768 1536 R90
SYMATTR InstName O84
SYMATTR Value clk1
SYMBOL cap 832 1472 R270
WINDOW 0 32 32 VTop 2
WINDOW 3 0 32 VBottom 2
SYMATTR InstName C60
SYMATTR Value {cin}
SYMBOL ltline 768 1680 R90
SYMATTR InstName O85
SYMATTR Value clk1
SYMBOL ltline 768 1856 R90
SYMATTR InstName O86
SYMATTR Value clk1
SYMBOL cap 832 1792 R270
WINDOW 0 32 32 VTop 2
WINDOW 3 0 32 VBottom 2
SYMATTR InstName C61
SYMATTR Value {cin}
SYMBOL ltline 448 832 R90
SYMATTR InstName O87
SYMATTR Value clk1
SYMBOL ltline 448 1008 R90
SYMATTR InstName O88
SYMATTR Value clk1
SYMBOL cap 512 944 R270
WINDOW 0 32 32 VTop 2
WINDOW 3 0 32 VBottom 2
SYMATTR InstName C62
SYMATTR Value {cin}
SYMBOL ltline 448 1152 R90
SYMATTR InstName O89
SYMATTR Value clk1
SYMBOL ltline 448 1328 R90
SYMATTR InstName O90
SYMATTR Value clk1
SYMBOL cap 512 1264 R270
WINDOW 0 32 32 VTop 2
WINDOW 3 0 32 VBottom 2
SYMATTR InstName C63
SYMATTR Value {cin}
SYMBOL ltline 448 1504 R90
SYMATTR InstName O91
SYMATTR Value clk1
SYMBOL cap 512 1440 R270
WINDOW 0 32 32 VTop 2
WINDOW 3 0 32 VBottom 2
SYMATTR InstName C64
SYMATTR Value {cin}
SYMBOL ltline 448 1648 R90
SYMATTR InstName O92
SYMATTR Value clk1
SYMBOL ltline 448 1824 R90
SYMATTR InstName O93
SYMATTR Value clk1
SYMBOL cap 512 1760 R270
WINDOW 0 32 32 VTop 2
WINDOW 3 0 32 VBottom 2
SYMATTR InstName C65
SYMATTR Value {cin}
SYMBOL ltline 160 832 R90
SYMATTR InstName O94
SYMATTR Value clk1
SYMBOL ltline 160 1008 R90
SYMATTR InstName O95
SYMATTR Value clk1
SYMBOL cap 224 944 R270
WINDOW 0 32 32 VTop 2
WINDOW 3 0 32 VBottom 2
SYMATTR InstName C66
SYMATTR Value {cin}
SYMBOL ltline 160 1152 R90
SYMATTR InstName O96
SYMATTR Value clk1
SYMBOL ltline 160 1328 R90
SYMATTR InstName O97
SYMATTR Value clk1
SYMBOL cap 224 1264 R270
WINDOW 0 32 32 VTop 2
WINDOW 3 0 32 VBottom 2
SYMATTR InstName C67
SYMATTR Value {cin}
SYMBOL ltline 160 1504 R90
SYMATTR InstName O98
SYMATTR Value clk1
SYMBOL cap 224 1440 R270
WINDOW 0 32 32 VTop 2
WINDOW 3 0 32 VBottom 2
SYMATTR InstName C68
SYMATTR Value {cin}
SYMBOL ltline 160 1648 R90
SYMATTR InstName O99
SYMATTR Value clk1
SYMBOL ltline 160 1824 R90
SYMATTR InstName O100
SYMATTR Value clk1
SYMBOL cap 224 1760 R270
WINDOW 0 32 32 VTop 2
WINDOW 3 0 32 VBottom 2
SYMATTR InstName C69
SYMATTR Value {cin}
TEXT -210 280 Left 2 !.tran 1u
TEXT -360 552 Left 2 !.model clk ltra(R=4.857m C=1p L=18.6n Len=1)
TEXT -368 448 Left 2 !.model clk1 ako:clk len=0.84\n.model clk2 ako:clk len=1.34
TEXT -576 16 Left 2 !.param rsource 150\n;.step param rsource list 50 100 500
TEXT 368 656 Left 2 !.param cin 3.5p

The netlist it stands for:
* clock.asc
V1 N022 0 PULSE(0 5 0.1u 1n 1n 0.5u 1u)
R1 N024 N023 80
O1 N024 0 N025 0 clk1
O2 N025 0 N026 0 clk1
O3 N026 0 N027 0 clk1
O4 N027 0 N028 0 clk1
O5 N028 0 N029 0 clk1
O6 N029 0 N030 0 clk1
O7 N030 0 N031 0 clk1
O8 N031 0 N032 0 clk1
O9 N032 0 N033 0 clk1
O10 N033 0 N034 0 clk1
O11 N034 0 N035 0 clk1
O12 N036 0 N037 0 clk1
O13 N037 0 N038 0 clk1
O14 N038 0 N039 0 clk1
O15 N039 0 N040 0 clk1
O16 N040 0 N041 0 clk1
O17 N041 0 N042 0 clk1
O18 N042 0 N043 0 clk1
O19 N043 0 N044 0 clk1
O20 N044 0 N045 0 clk1
O21 N045 0 N046 0 clk1
O22 N046 0 N047 0 clk1
O23 N034 0 N046 0 clk1
V3 VIH 0 2
V2 VIL 0 0.7
C2 N029 0 {cin}
C3 N028 0 {cin}
C4 N034 0 {cin}
C5 N035 0 {cin}
C6 N033 0 {cin}
C7 N032 0 {cin}
C8 N031 0 {cin}
C9 N030 0 {cin}
C10 N027 0 {cin}
C11 N026 0 {cin}
C12 N025 0 {cin}
C13 N024 0 {cin}
C14 N046 0 {cin}
C15 N047 0 {cin}
C17 N045 0 {cin}
C18 N044 0 {cin}
C19 N043 0 {cin}
C20 N042 0 {cin}
C21 N041 0 {cin}
C22 N040 0 {cin}
C23 N039 0 {cin}
C24 N038 0 {cin}
C25 N037 0 {cin}
C26 N036 0 {cin}
C1 N023 0 250p
R3 N023 N022 50
O24 N034 0 N021 0 clk1
O25 N021 0 N018 0 clk1
C16 N021 0 {cin}
O26 N018 0 N015 0 clk1
O27 N015 0 N012 0 clk1
C27 N015 0 {cin}
O28 N012 0 N009 0 clk1
C28 N012 0 {cin}
O29 N009 0 N006 0 clk1
O30 N006 0 N003 0 clk1
C29 N006 0 {cin}
O31 N031 0 N020 0 clk1
O32 N020 0 N017 0 clk1
C30 N020 0 {cin}
O33 N017 0 N014 0 clk1
O34 N014 0 N011 0 clk1
C31 N014 0 {cin}
O35 N011 0 N008 0 clk1
C32 N011 0 {cin}
O36 N008 0 N005 0 clk1
O37 N005 0 N002 0 clk1
C33 N005 0 {cin}
O38 N027 0 N019 0 clk1
O39 N019 0 N016 0 clk1
C34 N019 0 {cin}
O40 N016 0 N013 0 clk1
O41 N013 0 N010 0 clk1
C35 N013 0 {cin}
O42 N010 0 N007 0 clk1
C36 N010 0 {cin}
O43 N007 0 N004 0 clk1
O44 N004 0 N001 0 clk1
C37 N004 0 {cin}
O45 N046 0 N051 0 clk1
O46 N051 0 N059 0 clk1
C38 N051 0 {cin}
O47 N059 0 N065 0 clk1
O48 N065 0 N075 0 clk1
C39 N065 0 {cin}
O49 N075 0 N083 0 clk1
C40 N075 0 {cin}
O50 N083 0 N089 0 clk1
O51 N089 0 N099 0 clk1
C41 N089 0 {cin}
O52 N045 0 N050 0 clk1
O53 N050 0 N058 0 clk1
C42 N050 0 {cin}
O54 N058 0 N064 0 clk1
O55 N064 0 N074 0 clk1
C43 N064 0 {cin}
O56 N074 0 N082 0 clk1
C44 N074 0 {cin}
O57 N082 0 N088 0 clk1
O58 N088 0 N098 0 clk1
C45 N088 0 {cin}
O59 N043 0 N049 0 clk1
O60 N049 0 N055 0 clk1
C46 N049 0 {cin}
O61 N055 0 N061 0 clk1
O62 N061 0 N071 0 clk1
C47 N061 0 {cin}
O63 N071 0 N079 0 clk1
C48 N071 0 {cin}
O64 N079 0 N085 0 clk1
O65 N085 0 N095 0 clk1
C49 N085 0 {cin}
O66 N041 0 N048 0 clk1
O67 N048 0 N054 0 clk1
C50 N048 0 {cin}
O68 N054 0 N060 0 clk1
O69 N060 0 N070 0 clk1
C51 N060 0 {cin}
O70 N070 0 N078 0 clk1
C52 N070 0 {cin}
O71 N078 0 N084 0 clk1
O72 N084 0 N094 0 clk1
C53 N084 0 {cin}
O73 N040 0 N057 0 clk1
O74 N057 0 N067 0 clk1
C54 N057 0 {cin}
O75 N067 0 N073 0 clk1
O76 N073 0 N081 0 clk1
C55 N073 0 {cin}
O77 N081 0 N091 0 clk1
C56 N081 0 {cin}
O78 N091 0 N097 0 clk1
O79 N097 0 N103 0 clk1
C57 N097 0 {cin}
O80 N038 0 N056 0 clk1
O81 N056 0 N066 0 clk1
C58 N056 0 {cin}
O82 N066 0 N072 0 clk1
O83 N072 0 N080 0 clk1
C59 N072 0 {cin}
O84 N080 0 N090 0 clk1
C60 N080 0 {cin}
O85 N090 0 N096 0 clk1
O86 N096 0 N102 0 clk1
C61 N096 0 {cin}
O87 N037 0 N053 0 clk1
O88 N053 0 N063 0 clk1
C62 N053 0 {cin}
O89 N063 0 N069 0 clk1
O90 N069 0 N077 0 clk1
C63 N069 0 {cin}
O91 N077 0 N087 0 clk1
C64 N077 0 {cin}
O92 N087 0 N093 0 clk1
O93 N093 0 N101 0 clk1
C65 N093 0 {cin}
O94 N036 0 N052 0 clk1
O95 N052 0 N062 0 clk1
C66 N052 0 {cin}
O96 N062 0 N068 0 clk1
O97 N068 0 N076 0 clk1
C67 N068 0 {cin}
O98 N076 0 N086 0 clk1
C68 N076 0 {cin}
O99 N086 0 N092 0 clk1
O100 N092 0 N100 0 clk1
C69 N092 0 {cin}
.tran 1u
.model clk ltra(R=4.857m C=1p L=18.6n Len=1)
.model clk1 ako:clk len=0.84
.model clk2 ako:clk len=1.34
.param rsource 150
;.step param rsource list 50 100 500
.param cin 3.5p
.backanno
.end